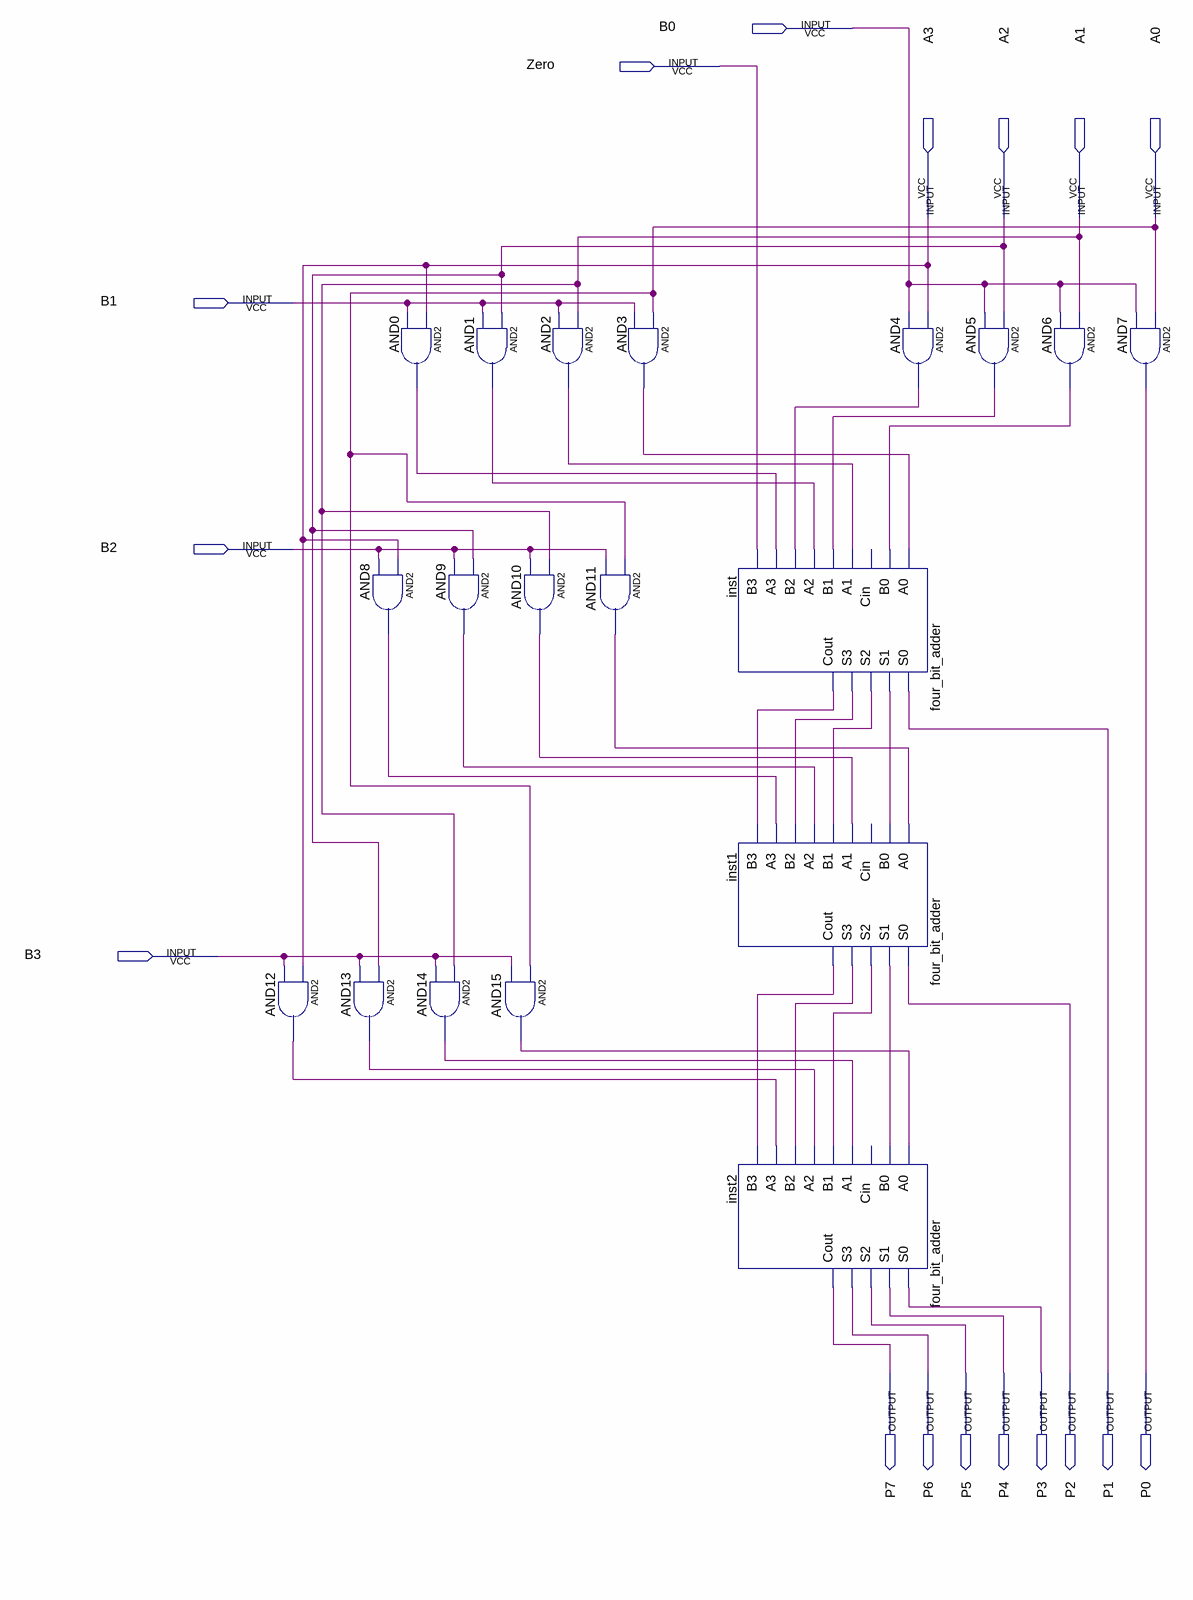
[diagram p0: schematic sheet]
// Quartus schematic four_bit_multiplier.bdf as structural Verilog: 19 symbols, 17 pins
module four_bit_multiplier (
  input  B0,
  input  Zero,
  input  A3,
  input  A2,
  input  A1,
  input  A0,
  input  B1,
  input  B2,
  input  B3,
  output P7,
  output P6,
  output P5,
  output P4,
  output P3,
  output P2,
  output P1,
  output P0
);

  wire AND0_out, AND1_out, AND2_out, AND3_out, AND4_out, AND5_out, AND6_out, AND8_out, AND9_out, AND10_out,
       AND11_out, AND12_out, AND13_out, AND14_out, AND15_out, inst1_cout, inst1_s1, inst1_s2, inst1_s3,
       inst_cout, inst_s1, inst_s2, inst_s3;

  and AND12 (AND12_out, A3, B3);
  and AND0 (AND0_out, A3, B1);
  and AND8 (AND8_out, A3, B2);
  and AND13 (AND13_out, A2, B3);
  and AND1 (AND1_out, A2, B1);
  and AND9 (AND9_out, A2, B2);
  and AND14 (AND14_out, A1, B3);
  and AND2 (AND2_out, A1, B1);
  and AND10 (AND10_out, A1, B2);
  and AND15 (AND15_out, A0, B3);
  and AND3 (AND3_out, A0, B1);
  and AND11 (AND11_out, A0, B2);
  four_bit_adder inst (
    .A0(AND3_out), .B0(AND6_out), .A1(AND2_out), .B1(AND5_out), .A2(AND1_out), .B2(AND4_out), .A3(AND0_out),
    .B3(Zero), .S0(P1), .S1(inst_s1), .S2(inst_s2), .S3(inst_s3), .Cout(inst_cout));  // open: Cin
  four_bit_adder inst1 (
    .A0(AND11_out), .B0(inst_s1), .A1(AND10_out), .B1(inst_s2), .A2(AND9_out), .B2(inst_s3), .A3(AND8_out),
    .B3(inst_cout), .S0(P2), .S1(inst1_s1), .S2(inst1_s2), .S3(inst1_s3), .Cout(inst1_cout));  // open: Cin
  four_bit_adder inst2 (
    .A0(AND15_out), .B0(inst1_s1), .A1(AND14_out), .B1(inst1_s2), .A2(AND13_out), .B2(inst1_s3),
    .A3(AND12_out), .B3(inst1_cout), .S0(P3), .S1(P4), .S2(P5), .S3(P6), .Cout(P7));  // open: Cin
  and AND4 (AND4_out, A3, B0);
  and AND5 (AND5_out, A2, B0);
  and AND6 (AND6_out, A1, B0);
  and AND7 (P0, A0, B0);
endmodule
